# EAGLE design vibrator (EAGLE 5.10)
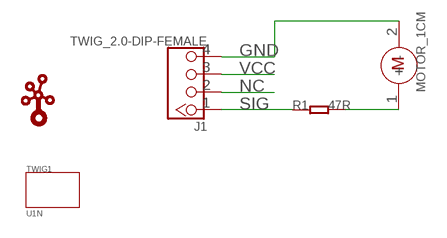
[diagram p0: schematic, sheet 1]

## Parts
J1  TWIG_2.0-DIP-FEMALE  [2.0_1X4]
M1  MOTOR_1CM  [MOTOR_1CM]
R1  47R  005-R0603_S  [0603_S]
TWIG1  U1N  [U1N]
U$1  TWIGLOGOTWIGLOGO_SMALL  [TWIGLOGO_SMALL]

## Nets
GND: J1.4 M1.2(-)
N$2: M1.1(+) R1.2
NC: J1.2
SIG: J1.1 R1.1
VCC: J1.3

## Library data of the parts
J1 = Connector:TWIG_2.0-DIP-FEMALE
M1 = EXT_moudle:MOTOR_1CM
R1 = Discrete:005-R*
TWIG1 = EXT_moudle:U1N
U$1 = seeedleo:TWIGLOGO

## Board
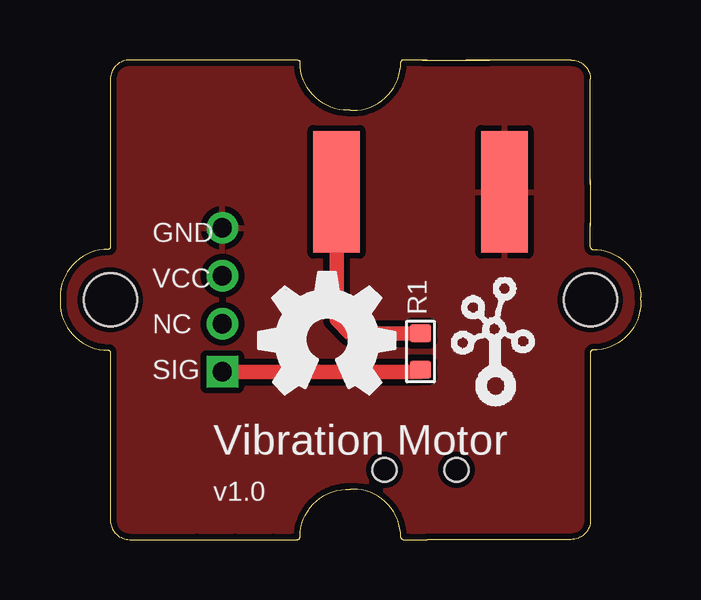
[diagram p1: board, top side]
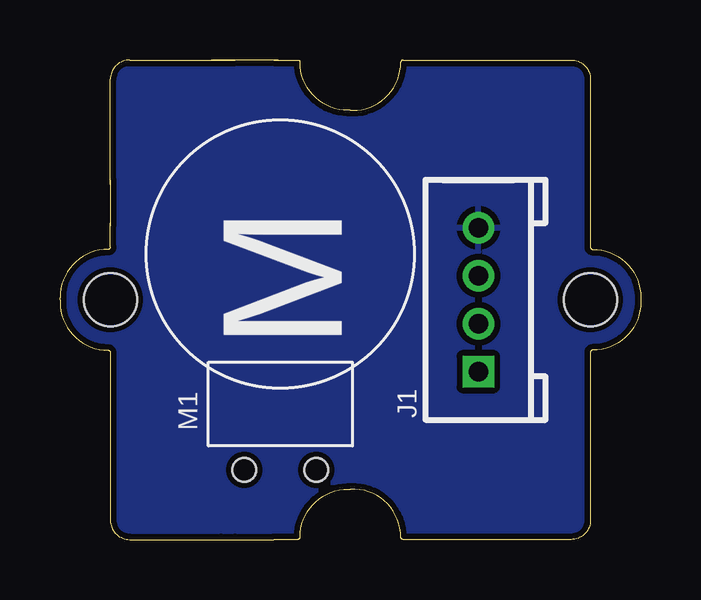
[diagram p2: board, bottom side, seen from below]

Size 24.2 x 20 mm. Coordinates in mm from the lower left corner, seen from the top.
Copper layers (1*16): Top 0.035mm / dielectric 1.5mm / Bottom 0.035mm
Design rules "SeeedStudio_rule_no_angle_090911 *": minimum track width 6mil, minimum drill 12mil, track to track 6mil, track to pad 6mil, pad to pad 6mil, via to via 6mil, smd to smd 0mil, copper to edge 10mil, drill to drill 10mil, minimum pad ring 10mil, minimum via ring 6mil, stop-mask expansion 2mil, vias tented up to drill 100mil, thermal gap 10mil

### Footprints (pad centres in the part's own frame; a part is rotated, then mirrored left to right if it is on the bottom)
2.0_1X4 = drill 0.8 pad 1.27 square: 1 -3,0 | drill 0.8 pad 1.27: 2 -1,0; 3 1,0; 4 3,0
MOTOR_1CM = smd 5.08 x 1.93 bottom: 1 -2.595,3.5; 2 -2.595,-3.5 | hole 1: 9,1.5; 9,-1.5
0603_S = smd 0.762 x 0.889: 1 -0.762,0; 2 0.762,0
U1N = hole 2.2: 0,-10; 0,10

### Placement (x,y rotation side)
J1  6.77,10 90 bottom
M1  15.02,11.9 270 bottom
R1  15.02,7.84 90 top
TWIG1  12.1,10 270 bottom
U$1  15.91,5.43 0 top
U$2  [OSHW_FILLX200_NOTEXT]  8.29,6.06 0 top

### Tracks (layer width: path | path; a pad name or v marks a point on that pad's centre or on a via)
GND
  pour Bottom (isolate 0.254): -0.6,20.16 -0.6,0.09 arc90 -0.35,-0.16 24.16,-0.16 24.16,19.91 arc90 23.91,20.16
  pour Top (isolate 0.254): -0.6,20.16 -0.6,0.09 arc90 -0.35,-0.16 24.16,-0.16 24.16,19.91 arc90 23.91,20.16
N$2
  Top 0.61: M1.1 11.52,9.18 12.1,8.6 R1.2
SIG
  Top 0.61: J1.1 15.02,7 R1.1

### Text on the board
tPlace: GND | VCC | NC | SIG | Vibration Motor | v1.0